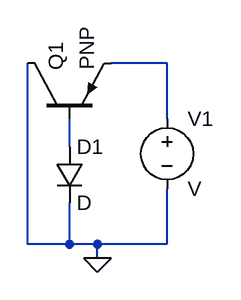
[diagram p0: schematic pnp_test1.asc]
pnp_test1.asc, the LTspice schematic file:
Version 4.1
SHEET 1 880 680
WIRE 224 96 160 96
WIRE 224 160 224 96
WIRE 112 192 112 160
WIRE 64 304 64 96
WIRE 112 304 112 256
WIRE 112 304 64 304
WIRE 144 304 112 304
WIRE 224 304 224 240
WIRE 224 304 144 304
WIRE 144 320 144 304
FLAG 144 320 0
SYMBOL diode 96 192 R0
SYMATTR InstName D1
SYMBOL pnp 64 160 R270
SYMATTR InstName Q1
SYMBOL voltage 224 144 R0
SYMATTR InstName V1

The netlist it stands for:
* pnp_test1.asc
D1 N002 0 D
Q1 0 N002 N001 0 PNP
V1 N001 0 V
.model D D
.lib standard.dio
.model NPN NPN
.model PNP PNP
.lib standard.bjt
.backanno
.end